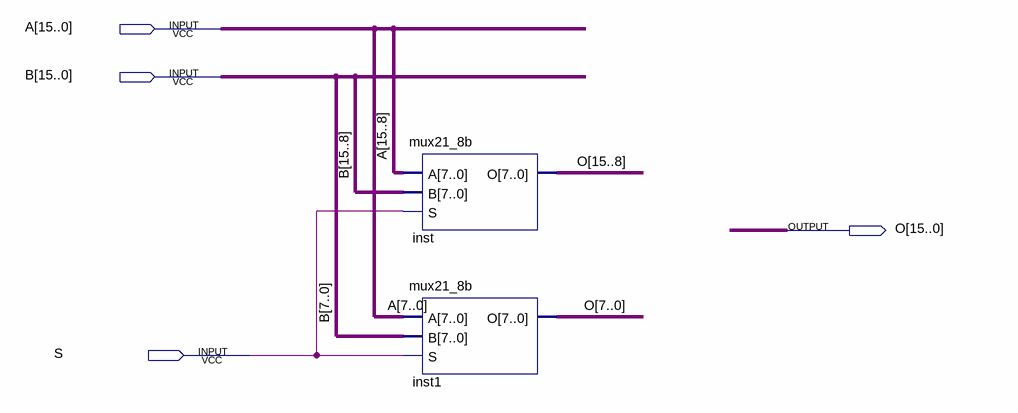
[diagram p0: schematic sheet]
// Quartus schematic mux21_16b.bdf as structural Verilog: 2 symbols, 4 pins
module mux21_16b (
  input  [15:0] A,
  input  [15:0] B,
  input  S,
  output [15:0] O
);

  mux21_8b inst (.A(A[15:8]), .B(B[15:8]), .S(S), .O(O[15:8]));
  mux21_8b inst1 (.A(A[7:0]), .B(B[7:0]), .S(S), .O(O[7:0]));
endmodule
